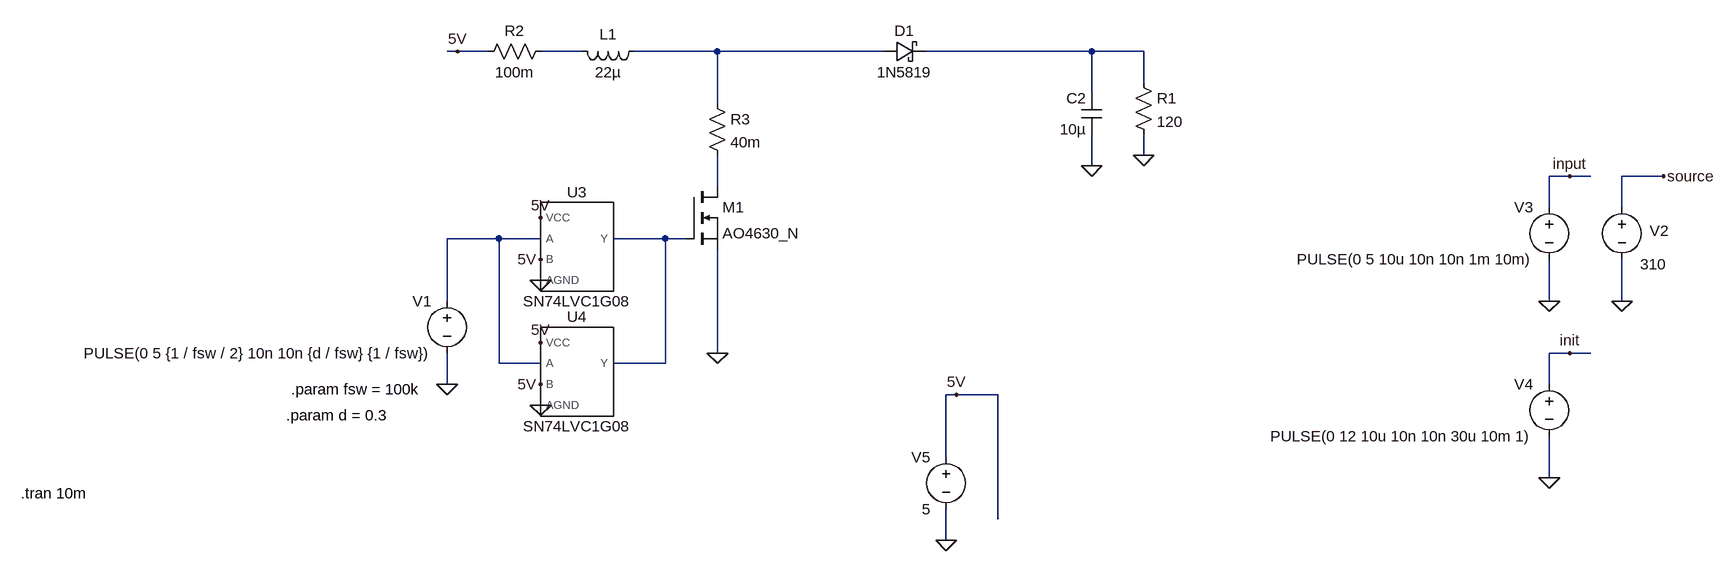
[diagram p0: schematic DC_fan_boost.asc]
DC_fan_boost.asc, the LTspice schematic file:
Version 4
SHEET 1 1596 788
WIRE -352 -48 -368 -48
WIRE -304 -48 -352 -48
WIRE -160 -48 -224 -48
WIRE 48 -48 -80 -48
WIRE 304 -48 48 -48
WIRE 624 -48 368 -48
WIRE 704 -48 624 -48
WIRE 704 0 704 -48
WIRE 624 16 624 -48
WIRE 48 32 48 -48
WIRE 704 112 704 80
WIRE 624 128 624 80
WIRE 1360 144 1328 144
WIRE 1392 144 1360 144
WIRE 1504 144 1440 144
WIRE 48 160 48 112
WIRE 1328 192 1328 144
WIRE 1440 192 1440 144
WIRE -288 240 -368 240
WIRE -224 240 -288 240
WIRE -32 240 -112 240
WIRE 0 240 -32 240
WIRE -368 336 -368 240
WIRE 1328 336 1328 272
WIRE 1440 336 1440 272
WIRE 48 416 48 256
WIRE 1360 416 1328 416
WIRE 1392 416 1360 416
WIRE -288 432 -288 240
WIRE -224 432 -288 432
WIRE -32 432 -32 240
WIRE -32 432 -112 432
WIRE -368 464 -368 416
WIRE 1328 464 1328 416
WIRE 416 480 400 480
WIRE 480 480 416 480
WIRE 400 576 400 480
WIRE 1328 608 1328 544
WIRE 480 672 480 480
WIRE 400 704 400 656
FLAG -368 464 0
FLAG -224 304 0
FLAG -224 208 5V
FLAG -224 272 5V
FLAG 624 128 0
FLAG 704 112 0
FLAG -224 496 0
FLAG -224 400 5V
FLAG -224 464 5V
FLAG -352 -48 5V
FLAG 1440 336 0
FLAG 1360 144 input
FLAG 1504 144 source
FLAG 1328 336 0
FLAG 1360 416 init
FLAG 1328 608 0
FLAG 48 416 0
FLAG 400 704 0
FLAG 416 480 5V
SYMBOL voltage -368 320 M0
WINDOW 123 0 0 Left 0
WINDOW 39 0 0 Left 0
SYMATTR InstName V1
SYMATTR Value PULSE(0 5 {1 / fsw / 2} 10n 10n {d / fsw} {1 / fsw})
SYMBOL schottky 304 -32 R270
WINDOW 0 32 32 VTop 2
WINDOW 3 0 32 VBottom 2
SYMATTR InstName D1
SYMATTR Value 1N5819
SYMATTR Description Diode
SYMATTR Type diode
SYMBOL res 688 -16 R0
SYMATTR InstName R1
SYMATTR Value 120
SYMBOL cap 640 80 R180
WINDOW 0 24 56 Left 2
WINDOW 3 24 8 Left 2
SYMATTR InstName C2
SYMATTR Value 10µ
SYMBOL voltage 1440 176 R0
WINDOW 123 0 0 Left 0
WINDOW 39 0 0 Left 0
WINDOW 0 72 52 Right 2
WINDOW 3 69 103 Right 2
SYMATTR InstName V2
SYMATTR Value 310
SYMBOL voltage 1328 176 M0
WINDOW 123 0 0 Left 0
WINDOW 39 0 0 Left 0
SYMATTR InstName V3
SYMATTR Value PULSE(0 5 10u 10n 10n 1m 10m)
SYMBOL voltage 1328 448 M0
WINDOW 123 0 0 Left 0
WINDOW 39 0 0 Left 0
SYMATTR InstName V4
SYMATTR Value PULSE(0 12 10u 10n 10n 30u 10m 1)
SYMBOL nmos 0 160 R0
SYMATTR InstName M1
SYMATTR Value AO4630_N
SYMBOL ind -64 -64 R90
WINDOW 0 5 56 VBottom 2
WINDOW 3 32 56 VTop 2
SYMATTR InstName L1
SYMATTR Value 22µ
SYMBOL voltage 400 560 M0
WINDOW 123 0 0 Left 0
WINDOW 39 0 0 Left 0
SYMATTR InstName V5
SYMATTR Value 5
SYMBOL SN74LVC1G08 -176 240 R0
SYMATTR InstName U3
SYMBOL SN74LVC1G08 -176 432 R0
SYMATTR InstName U4
SYMBOL res -208 -64 R90
WINDOW 0 0 56 VBottom 2
WINDOW 3 32 56 VTop 2
SYMATTR InstName R2
SYMATTR Value 100m
SYMBOL res 32 16 R0
SYMATTR InstName R3
SYMATTR Value 40m
TEXT -1024 632 Left 2 !.tran 10m
TEXT -608 472 Left 2 !.param fsw = 100k
TEXT -616 512 Left 2 !.param d = 0.3

The netlist it stands for:
* DC_fan_boost.asc
V1 N005 0 PULSE(0 5 {1 / fsw / 2} 10n 10n {d / fsw} {1 / fsw})
D1 N002 N003 1N5819
R1 N003 0 120
C2 0 N003 10µ
V2 source 0 310
V3 input 0 PULSE(0 5 10u 10n 10n 1m 10m)
V4 init 0 PULSE(0 12 10u 10n 10n 30u 10m 1)
M1 N004 N006 0 0 AO4630_N
L1 N002 N001 22µ
V5 5V 0 5
XU3 N006 N005 5V 5V 0 SN74LVC1G08  ; pins Y A B VCC AGND
XU4 N006 N005 5V 5V 0 SN74LVC1G08  ; pins Y A B VCC AGND
R2 N001 5V 100m
R3 N002 N004 40m
.model D D
.lib standard.dio
.model NMOS NMOS
.model PMOS PMOS
.lib standard.mos
.tran 10m
.param fsw = 100k
.param d = 0.3
.lib SN74LVC1G08.cir
.backanno
.end